# Altium schematic sheet Transmitter-2.4GHz.SchDoc
size B; SheetNumber: 2; SheetTotal: 4
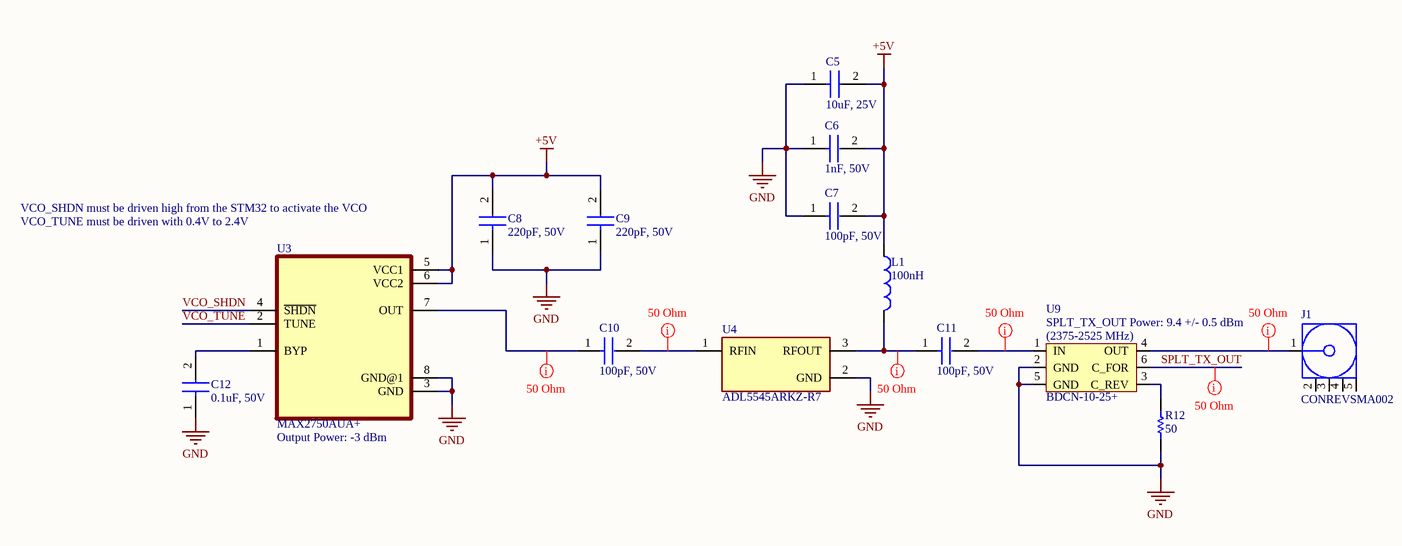
[diagram p0: Transmitter-2.4GHz.SchDoc]

## Parts
C5  10uF, 25V  [CAP_CL31_SAM]
C6  1nF, 50V  [FP-0603-L_1_6_0_15-W_0_81-IPC_C]
C7  100pF, 50V  [CAPC17595_87N_KEM]
C8  220pF, 50V  [CAPC17595_87N_KEM]
C9  220pF, 50V  [CAPC17595_87N_KEM]
C10  100pF, 50V  [CAP_CC0402_YAG]
C11  100pF, 50V  [CAP_CC0402_YAG]
C12  0.1uF, 50V  [CAP_CC0603_YAG-M]
J1  CONREVSMA002  [CON-REVSMA-RA]
L1  100nH  [INDC1608X95N]
R12  50  [RESC1005X35N]
U3  MAX2750AUA+  [SOP65P490X110-8N]
U4  ADL5545ARKZ-R7  [ADL5545ARKZ-R7]
U9  BDCN-10-25+  [BDCN-10-25+]

## Nets
+5V: C5.2 C6.2 C7.2 C8.2 C9.2 L1.1 U3.5(VCC1) U3.6(VCC2)
GND: C5.1 C6.1 C7.1 C8.1 C9.1 C12.1 R12.1 U3.3(GND) U3.8(GND@1) U4.2(GND) U9.2(GND) U9.5(GND)
SPLT_TX_OUT: U9.6(C_FOR)
VCO_SHDN: U3.4(~{SHDN})
VCO_TUNE: U3.2(TUNE)
NetC10_1: C10.1 U3.7(OUT)
NetC10_2: C10.2 U4.1(RFIN)
NetC11_1: C11.1 L1.2 U4.3(RFOUT)
NetC11_2: C11.2 U9.1(IN)
NetC12_2: C12.2 U3.1(BYP)
NetJ1_1: J1.1(Signal) U9.4(OUT)
NetR12_2: R12.2 U9.3(C_REV)

Not connected (* = marked no-connect by the designer): J1 2(GND) 3(GND) 4(GND) 5(GND)

## Layout directives
net class RF_Trace: NetC10_1, NetC10_2, NetC11_1, NetC11_2, NetJ1_1, SPLT_TX_OUT

## Notes on the sheet
- VCO_SHDN must be driven high from the STM32 to activate the VCO
- (near U3) VCO_TUNE must be driven with 0.4V to 2.4V
- (near U9) SPLT_TX_OUT Power: 9.4 +/- 0.5 dBm
- (near U9) (2375-2525 MHz)
- (near U3) Output Power: -3 dBm

## Library data of the parts
C5 = CL31B106KAHNNNE: Ceramic Capacitor, Multilayer, Ceramic, 25V, 10% +Tol, 10% -Tol, X7R, 15% TC, 10uF, Surface Mount, 1206; Manufacturer: Samsung; Multilayer: Yes; Supplier: Digikey; Supplier Part Number: 1276-1804-1-ND; Manufacturer Part Number: CL31B106KAHNNNE; RoHS: Yes; Category: Ceramic Capacitors; Stock: 2651645; Pricing: 1=0.1, 10=0.043, 100=0.0358 (USD); Mounting Technology: Surface Mount; Pins: 2; Dielectric Material: Ceramic; Package Shape: Rectangular; Case/Package: 1206; Terminal Finish: Nickel; Min Operating Temperature: -55°C; Max Operating Temperature: 125°C; JESD-609 Code: e3; Value: 10uF; Capacitor Type: Ceramic; Tolerance  (fill in as +-): 10%; Package Style: SMTMeter; Packaging: Tape and Reel; Tolerance (fill in as +-): 10%; Rated DC Voltage (URdc): 25V; Temperature Characteristics Code: X7R; Termination: Wraparound; Length: 3.2mm; Width: 1.6mm; Height: 1.8mm; Reach SVHC Compliant: Yes; RoHS Compliant: Yes; ComponentLink1URL: https://datasheet.ciiva.com:443/pdfs/VipMasterIC/IC/SEMS/SEMS-S-A0008384515/SEMS-S-A0008872888-1.pdf?src-supplier=IHS+Markit; ComponentLink1Description: https://datasheet.ciiva.com:443/pdfs/VipMasterIC/IC/SEMS/SEMS-S-A0008384515/SEMS-S-A0008872888-1.pdf?src-supplier=IHS+Markit; ComponentLink2URL: https://datasheet.ciiva.com/25795/cl31b106kahnnne-25795260.pdf?src-supplier=Digikey; ComponentLink2Description: https://datasheet.ciiva.com/25795/cl31b106kahnnne-25795260.pdf?src-supplier=Digikey; ComponentLink3URL: https://datasheet.ciiva.com/26838/getdatasheetpartid-356415-26838914.pdf?src-supplier=Verical; ComponentLink3Description: https://datasheet.ciiva.com/26838/getdatasheetpartid-356415-26838914.pdf?src-supplier=Verical; ComponentLink4URL: https://datasheet.ciiva.com/16498/cl03a105mq3csnc-16498474.pdf?src-supplier=Future+Electronics; ComponentLink4Description: https://datasheet.ciiva.com/16498/cl03a105mq3csnc-16498474.pdf?src-supplier=Future+Electronics
C6 = 06035A102JAT2A: Ceramic Capacitor, Multilayer, Ceramic, 50V, 5% +Tol, 5% -Tol, C0G, 30ppm/Cel TC, 0.001uF, Surface Mount, 0603; Manufacturer: Kyocera AVX; Multilayer: Yes; Supplier: Digikey; Supplier Part Number: 478-KGM15ACG1H102JTCT-ND; Manufacturer Part Number: 06035A102JAT2A; RoHS: Yes; Category: Ceramic Capacitors; Stock: 540000; Pricing: 4000=0.00488, 8000=0.00454, 16000=0.00447, 24000=0.00439, 32000=0.00431 (USD); Mounting Technology: Surface Mount; Pins: 2; Dielectric Material: Ceramic; Package Shape: Rectangular; Case/Package: 0603; Terminal Finish: Nickel; Min Operating Temperature: -55°C; Max Operating Temperature: 125°C; JESD-609 Code: e3; Value: 1nF; Capacitor Type: Ceramic; Tolerance  (fill in as +-): 5%; Package Style: SMTMeter; Packaging: Tape and Reel; Tolerance (fill in as +-): 5%; Rated DC Voltage (URdc): 50V; Temperature Characteristics Code: C0G; Termination: Wraparound; Length: 1.6mm; Width: 0.81mm; Height: 0.9mm; RoHS Compliant: Yes; Reach SVHC Compliant: Yes; ComponentLink1URL: https://datasheet.ciiva.com:443/pdfs/VipMasterIC/IC/AVXC/AVXC-S-A0008899940/AVXC-S-A0008899940-1.pdf?src-supplier=IHS+Markit; ComponentLink1Description: https://datasheet.ciiva.com:443/pdfs/VipMasterIC/IC/AVXC/AVXC-S-A0008899940/AVXC-S-A0008899940-1.pdf?src-supplier=IHS+Markit; ComponentLink2URL: https://datasheet.ciiva.com/11786/0900766b802d4697-11786950.pdf?src-supplier=Rs; ComponentLink2Description: https://datasheet.ciiva.com/11786/0900766b802d4697-11786950.pdf?src-supplier=Rs; ComponentLink3URL: https://datasheet.ciiva.com/11464/ccog-11464573.pdf?src-supplier=Avnet; ComponentLink3Description: https://datasheet.ciiva.com/11464/ccog-11464573.pdf?src-supplier=Avnet; ComponentLink4URL: https://datasheet.ciiva.com/16363/ccog-16363640.pdf?src-supplier=Future+Electronics; ComponentLink4Description: https://datasheet.ciiva.com/16363/ccog-16363640.pdf?src-supplier=Future+Electronics; ComponentLink5URL: https://datasheet.ciiva.com/1124/759117-1124717.pdf?src-supplier=Element14; ComponentLink5Description: https://datasheet.ciiva.com/1124/759117-1124717.pdf?src-supplier=Element14; ComponentLink6URL: https://datasheet.ciiva.com/1124/759117-1124716.pdf?src-supplier=Element14; ComponentLink6Description: https://datasheet.ciiva.com/1124/759117-1124716.pdf?src-supplier=Element14; ComponentLink7URL: https://datasheet.ciiva.com/1466/26712-1466099.pdf?src-supplier=Farnell; ComponentLink7Description: https://datasheet.ciiva.com/1466/26712-1466099.pdf?src-supplier=Farnell; ComponentLink8URL: https://datasheet.ciiva.com/1124/26712-1124715.pdf?src-supplier=Element14; ComponentLink8Description: https://datasheet.ciiva.com/1124/26712-1124715.pdf?src-supplier=Element14; ComponentLink9URL: https://datasheet.ciiva.com/150/ccog-150886.pdf?src-supplier=Digikey; ComponentLink9Description: https://datasheet.ciiva.com/150/ccog-150886.pdf?src-supplier=Digikey; ComponentLink10URL: https://datasheet.ciiva.com/150/ccog-150885.pdf?src-supplier=Digikey; ComponentLink10Description: https://datasheet.ciiva.com/150/ccog-150885.pdf?src-supplier=Digikey; ComponentLink11URL: https://datasheet.ciiva.com/150/ccog-150887.pdf?src-supplier=Digikey; ComponentLink11Description: https://datasheet.ciiva.com/150/ccog-150887.pdf?src-supplier=Digikey; ComponentLink12URL: https://datasheet.ciiva.com/14585/70001039-14585948.pdf?src-supplier=Allied+Electronics; ComponentLink12Description: https://datasheet.ciiva.com/14585/70001039-14585948.pdf?src-supplier=Allied+Electronics
C7 = C0603C101J5GACTU: Ceramic Capacitor, Multilayer, Ceramic, 50V, 5% +Tol, 5% -Tol, C0G, 30ppm/Cel TC, 0.0001uF, Surface Mount, 0603; Manufacturer: KEMET; Multilayer: Yes; Supplier: Digikey; Supplier Part Number: 399-C0603C101J5GACTUCT-ND; Manufacturer Part Number: C0603C101J5GACTU; RoHS: Yes; Category: Ceramic Capacitors; Stock: 772000; Pricing: 4000=0.0155, 8000=0.0104 (USD); Mounting Technology: Surface Mount; Pins: 2; Dielectric Material: Ceramic; Package Shape: Rectangular; Case/Package: 0603; Terminal Finish: Nickel; Min Operating Temperature: -55°C; Max Operating Temperature: 125°C; JESD-609 Code: e3; Value: 100pF; Capacitor Type: Ceramic; Tolerance  (fill in as +-): 5%; Package Style: SMTMeter; Packaging: Tape and Reel; Tolerance (fill in as +-): 5%; Rated DC Voltage (URdc): 50V; Temperature Characteristics Code: C0G; Termination: Wraparound; Length: 1.6mm; Width: 0.8mm; Height: 0.8mm; Reach SVHC Compliant: Yes; RoHS Compliant: Yes; ComponentLink1URL: https://datasheet.ciiva.com:443/pdfs/VipMasterIC/IC/KEME/KEME-S-A0005605168/KEME-S-A0005605168-1.pdf?src-supplier=IHS+Markit; ComponentLink1Description: https://datasheet.ciiva.com:443/pdfs/VipMasterIC/IC/KEME/KEME-S-A0005605168/KEME-S-A0005605168-1.pdf?src-supplier=IHS+Markit; ComponentLink2URL: https://datasheet.ciiva.com/6126/f9080b-0402-series-c0g-6126680.pdf?src-supplier=Farnell; ComponentLink2Description: https://datasheet.ciiva.com/6126/f9080b-0402-series-c0g-6126680.pdf?src-supplier=Farnell; ComponentLink3URL: https://datasheet.ciiva.com/28645/1789732-28645525.pdf?src-supplier=Element14; ComponentLink3Description: https://datasheet.ciiva.com/28645/1789732-28645525.pdf?src-supplier=Element14; ComponentLink4URL: https://datasheet.ciiva.com/7823/1725423-7823564.pdf?src-supplier=Element14; ComponentLink4Description: https://datasheet.ciiva.com/7823/1725423-7823564.pdf?src-supplier=Element14; ComponentLink5URL: https://datasheet.ciiva.com/7823/1725423-7823565.pdf?src-supplier=Element14; ComponentLink5Description: https://datasheet.ciiva.com/7823/1725423-7823565.pdf?src-supplier=Element14; ComponentLink6URL: https://datasheet.ciiva.com/7823/f9080b-0402-series-c0g-7823964.pdf?src-supplier=Element14; ComponentLink6Description: https://datasheet.ciiva.com/7823/f9080b-0402-series-c0g-7823964.pdf?src-supplier=Element14; ComponentLink7URL: https://datasheet.ciiva.com/7823/1372242-7823965.pdf?src-supplier=Element14; ComponentLink7Description: https://datasheet.ciiva.com/7823/1372242-7823965.pdf?src-supplier=Element14
C8 C9 = C0603C221J5GAC7411: Ceramic Capacitor, Multilayer, Ceramic, 50V, 5% +Tol, 5% -Tol, C0G, 30ppm/Cel TC, 0.00022uF, Surface Mount, 0603; Manufacturer: KEMET; Multilayer: Yes; Supplier: Digikey; Supplier Part Number: 399-C0603C221J5GAC7411CT-ND; Manufacturer Part Number: C0603C221J5GAC7411; RoHS: Yes; Category: Ceramic Capacitors; Stock: 30000; Pricing: 15000=0.0071, 30000=0.007, 45000=0.0069, 75000=0.0068, 150000=0.0067, 375000=0.0063, 750000=0.0063 (USD); Mounting Technology: Surface Mount; Pins: 2; Dielectric Material: Ceramic; Package Shape: Rectangular; Case/Package: 0603; Terminal Finish: Nickel; Min Operating Temperature: -55°C; Max Operating Temperature: 125°C; JESD-609 Code: e3; Value: 220pF; Capacitor Type: Ceramic; Tolerance  (fill in as +-): 5%; Package Style: SMTMeter; Packaging: Tape and Reel; Tolerance (fill in as +-): 5%; Rated DC Voltage (URdc): 50V; Temperature Characteristics Code: C0G; Termination: Wraparound; Length: 1.6mm; Width: 0.8mm; Height: 0.8mm; Reach SVHC Compliant: Yes; RoHS Compliant: Yes; ComponentLink1URL: https://datasheet.ciiva.com:443/pdfs/VipMasterIC/IC/KEME/KEME-S-A0007600110/KEME-S-A0007595965-1.pdf?src-supplier=IHS+Markit; ComponentLink1Description: https://datasheet.ciiva.com:443/pdfs/VipMasterIC/IC/KEME/KEME-S-A0007600110/KEME-S-A0007595965-1.pdf?src-supplier=IHS+Markit; ComponentLink2URL: https://datasheet.octopart.com/C0603C221J5GAC7411-KEMET-datasheet-149535035.pdf?src-supplier=Farnell; ComponentLink2Description: https://datasheet.octopart.com/C0603C221J5GAC7411-KEMET-datasheet-149535035.pdf?src-supplier=Farnell; ComponentLink3URL: https://api.kemet.com/component-edge/download/datasheet/C0603C221J5GAC7411.pdf?src-supplier=Digikey; ComponentLink3Description: https://api.kemet.com/component-edge/download/datasheet/C0603C221J5GAC7411.pdf?src-supplier=Digikey; ComponentLink4URL: https://datasheet.octopart.com/C0603C221J5GAC7411-Kemet-datasheet-11795438.pdf?src-supplier=Arrow+Electronics; ComponentLink4Description: https://datasheet.octopart.com/C0603C221J5GAC7411-Kemet-datasheet-11795438.pdf?src-supplier=Arrow+Electronics; ComponentLink5URL: https://datasheet.octopart.com/C0603C221J5GAC7411-Kemet-datasheet-5314449.pdf?src-supplier=Verical; ComponentLink5Description: https://datasheet.octopart.com/C0603C221J5GAC7411-Kemet-datasheet-5314449.pdf?src-supplier=Verical; ComponentLink6URL: https://datasheet.octopart.com/C0603C221J5GAC7411-KEMET-datasheet-157246123.pdf?src-supplier=Electro+Sonic; ComponentLink6Description: https://datasheet.octopart.com/C0603C221J5GAC7411-KEMET-datasheet-157246123.pdf?src-supplier=Electro+Sonic
C10 C11 = CC0402JRNPO9BN101: Ceramic Capacitor, Multilayer, Ceramic, 50V, 5% +Tol, 5% -Tol, C0G, 30ppm/Cel TC, 0.0001uF, Surface Mount, 0402; Manufacturer: Yageo; Multilayer: Yes; Supplier: Digikey; Supplier Part Number: 311-1024-1-ND; Manufacturer Part Number: CC0402JRNPO9BN101; RoHS: Yes; Category: Ceramic Capacitors; Stock: 5534890; Pricing: 1=0.08, 10=0.013, 100=0.008, 1000=0.0056, 2500=0.004, 10000=0.0032 (USD); Mounting Technology: Surface Mount; Pins: 2; Dielectric Material: Ceramic; Package Shape: Rectangular; Case/Package: 0402; Terminal Finish: Nickel; Min Operating Temperature: -55°C; Max Operating Temperature: 125°C; JESD-609 Code: e3; Value: 100pF; Capacitor Type: Ceramic; Tolerance  (fill in as +-): 5%; Package Style: SMTMeter; Packaging: Tape and Reel; Tolerance (fill in as +-): 5%; Rated DC Voltage (URdc): 50V; Temperature Characteristics Code: C0G; Termination: Wraparound; Length: 1mm; Width: 0.5mm; Height: 0.5mm; Reach SVHC Compliant: Yes; RoHS Compliant: Yes; ComponentLink1URL: https://datasheet.ciiva.com:443/pdfs/VipMasterIC/IC/YAGO/YAGO-S-A0009251638/YAGO-S-A0009251638-1.pdf?src-supplier=IHS+Markit; ComponentLink1Description: https://datasheet.ciiva.com:443/pdfs/VipMasterIC/IC/YAGO/YAGO-S-A0009251638/YAGO-S-A0009251638-1.pdf?src-supplier=IHS+Markit; ComponentLink2URL: https://datasheet.ciiva.com/23767/25787-23767888.pdf?src-supplier=Newark; ComponentLink2Description: https://datasheet.ciiva.com/23767/25787-23767888.pdf?src-supplier=Newark; ComponentLink3URL: https://datasheet.ciiva.com/11786/0900766b80d84fbf-11786101.pdf?src-supplier=Rs; ComponentLink3Description: https://datasheet.ciiva.com/11786/0900766b80d84fbf-11786101.pdf?src-supplier=Rs; ComponentLink4URL: https://datasheet.ciiva.com/28450/1443161-28450220.pdf?src-supplier=Element14; ComponentLink4Description: https://datasheet.ciiva.com/28450/1443161-28450220.pdf?src-supplier=Element14; ComponentLink5URL: https://datasheet.ciiva.com/143/mlccorderingcode-143989.pdf?src-supplier=Digikey; ComponentLink5Description: https://datasheet.ciiva.com/143/mlccorderingcode-143989.pdf?src-supplier=Digikey; ComponentLink6URL: https://datasheet.ciiva.com/143/mlccorderingcode-143990.pdf?src-supplier=Digikey; ComponentLink6Description: https://datasheet.ciiva.com/143/mlccorderingcode-143990.pdf?src-supplier=Digikey; ComponentLink7URL: https://datasheet.ciiva.com/143/mlccorderingcode-143991.pdf?src-supplier=Digikey; ComponentLink7Description: https://datasheet.ciiva.com/143/mlccorderingcode-143991.pdf?src-supplier=Digikey; ComponentLink8URL: https://datasheet.ciiva.com/8033/1443161-8033598.pdf?src-supplier=Element14; ComponentLink8Description: https://datasheet.ciiva.com/8033/1443161-8033598.pdf?src-supplier=Element14
C12 = CC0603JRX7R9BB104: Ceramic Capacitor, Multilayer, Ceramic, 50V, 5% +Tol, 5% -Tol, X7R, 15% TC, 0.1uF, Surface Mount, 0603; Manufacturer: Yageo; Value: 100nF; Multilayer: Yes; Supplier: Digikey; Supplier Part Number: 311-1779-1-ND; Manufacturer Part Number: CC0603JRX7R9BB104; RoHS: Yes; Category: Ceramic Capacitors; Stock: 91480; Pricing: 1=0.1, 10=0.05, 100=0.0297, 1000=0.01795 (USD); Mounting Technology: Surface Mount; Pins: 2; Dielectric Material: Ceramic; Package Shape: Rectangular; Case/Package: 0603; Terminal Finish: Nickel; Min Operating Temperature: -55°C; Max Operating Temperature: 125°C; JESD-609 Code: e3; Capacitor Type: Ceramic; Tolerance  (fill in as +-): 5%; Package Style: SMTMeter; Packaging: Tape and Reel; Tolerance (fill in as +-): 5%; Rated DC Voltage (URdc): 50V; Temperature Characteristics Code: X7R; Termination: Wraparound; Length: 1.6mm; Width: 0.8mm; Height: 0.8mm; Reach SVHC Compliant: Yes; RoHS Compliant: Yes; ComponentLink1URL: https://datasheet.ciiva.com:443/pdfs/VipMasterIC/IC/YAGO/YAGO-S-A0003557223/YAGO-S-A0003557223-1.pdf?src-supplier=IHS+Markit; ComponentLink1Description: https://datasheet.ciiva.com:443/pdfs/VipMasterIC/IC/YAGO/YAGO-S-A0003557223/YAGO-S-A0003557223-1.pdf?src-supplier=IHS+Markit; ComponentLink2URL: https://datasheet.ciiva.com/11465/upy-gphc-x7r-6-3v-to-50v-8-11465038.pdf?src-supplier=Avnet; ComponentLink2Description: https://datasheet.ciiva.com/11465/upy-gphc-x7r-6-3v-to-50v-8-11465038.pdf?src-supplier=Avnet
J1 = CONREVSMA002: RF SMA Connector; Manufacturer: Linx; Supplier: Digikey; Supplier Part Number: CONREVSMA002-ND; Manufacturer Part Number: CONREVSMA002; RoHS: Yes; Category: RF / Coaxial Connectors; Stock: 5396; Pricing: 1=2.78, 250=2.58, 500=2.41002, 1000=2.2625 (USD); Connector Type: SMA; Reach SVHC Compliant: Yes; RoHS Compliant: Yes; ComponentLink1URL: https://datasheet.ciiva.com:443/pdfs/VipMasterIC/IC/LNNC/LNNC-S-A0004850234/LNNC-S-A0004850234-1.pdf?src-supplier=IHS+Markit; ComponentLink1Description: https://datasheet.ciiva.com:443/pdfs/VipMasterIC/IC/LNNC/LNNC-S-A0004850234/LNNC-S-A0004850234-1.pdf?src-supplier=IHS+Markit; ComponentLink2URL: https://datasheet.ciiva.com/644/conrevsma002-644109.pdf?src-supplier=Digikey; ComponentLink2Description: https://datasheet.ciiva.com/644/conrevsma002-644109.pdf?src-supplier=Digikey; ComponentLink3URL: https://datasheet.ciiva.com/16225/conrevsma002-16225213.pdf?src-supplier=Future+Electronics; ComponentLink3Description: https://datasheet.ciiva.com/16225/conrevsma002-16225213.pdf?src-supplier=Future+Electronics
L1 = LQG18HNR10J00D: General Purpose Inductor, 0.1uH, 5%, 1 Element, Air-Core, SMD, 0603; Manufacturer: Murata; Core Material: Air; Case/Size Code: 0603; DC Resistance (DCR): 900mR; Inductor Application: RF INDUCTOR; Channels: 1; Quality Factor-Min (at L-nom): 12; Max Current Rating: 350mA; Self Resonant Frequency: 800MHz; Shape/Size Description: RECTANGULAR PACKAGE; Shielding: Unshielded; Test Frequency: 100MHz; Package Height: 0.8mm; Package Length: 1.6mm; Supplier: Digikey; Supplier Part Number: 490-6586-1-ND; Manufacturer Part Number: LQG18HNR10J00D; RoHS: Yes; Category: Fixed Inductors; Stock: 24486; Pricing: 1=0.18, 10=0.144, 50=0.144, 100=0.119, 1000=0.098, 10000=0.066 (USD); Pins: 2; Terminal Finish: Tin; Min Operating Temperature: -40°C; Max Operating Temperature: 85°C; Tolerance: 5%; JESD-609 Code: e3; Construction: Multilayer Chip; Inductance-Nom (L): 0.1uH; Inductor Type: GENERAL PURPOSE INDUCTOR; Package Style: SMTMeter; Packaging: Tape and Reel; Surface Mount: Yes; Terminal Placement: Dual Ended; Termination: Wraparound; Package Width: 0.8mm; Reach SVHC Compliant: Yes; RoHS Compliant: Yes; ComponentLink1URL: https://datasheet.ciiva.com:443/pdfs/VipMasterIC/IC/MURE/MURE-S-A0008911298/MURE-S-A0008911379-1.pdf?src-supplier=IHS+Markit; ComponentLink1Description: https://datasheet.ciiva.com:443/pdfs/VipMasterIC/IC/MURE/MURE-S-A0008911298/MURE-S-A0008911379-1.pdf?src-supplier=IHS+Markit; ComponentLink2URL: https://datasheet.ciiva.com/11801/0900766b80f1087c-11801431.pdf?src-supplier=Rs; ComponentLink2Description: https://datasheet.ciiva.com/11801/0900766b80f1087c-11801431.pdf?src-supplier=Rs; ComponentLink3URL: https://datasheet.ciiva.com/6710/l0075s0083lqg18h-6710060.pdf?src-supplier=Digikey; ComponentLink3Description: https://datasheet.ciiva.com/6710/l0075s0083lqg18h-6710060.pdf?src-supplier=Digikey; ComponentLink4URL: https://datasheet.ciiva.com/6710/l0075s0083lqg18h-6710062.pdf?src-supplier=Digikey; ComponentLink4Description: https://datasheet.ciiva.com/6710/l0075s0083lqg18h-6710062.pdf?src-supplier=Digikey; ComponentLink5URL: https://datasheet.ciiva.com/8002/5102-8002605.pdf?src-supplier=Element14; ComponentLink5Description: https://datasheet.ciiva.com/8002/5102-8002605.pdf?src-supplier=Element14; ComponentLink6URL: https://datasheet.ciiva.com/8002/5102-8002606.pdf?src-supplier=Element14; ComponentLink6Description: https://datasheet.ciiva.com/8002/5102-8002606.pdf?src-supplier=Element14
R12 = RT0402BRE0750RL: Fixed Resistor, Thin Film, 0.0625W, 50ohm, 50V, 0.1% +/-Tol, 50ppm/Cel, Surface Mount, 0402; Manufacturer: Yageo; Additional Feature: LASER TRIMMABLE; Power: 62.5mW; Rated Temperature: 70°C; Value: 50R; Supplier: Digikey; Supplier Part Number: 13-RT0402BRE0750RLCT-ND; Manufacturer Part Number: RT0402BRE0750RL; RoHS: Yes; Category: Chip SMD Resistors; Stock: 2520; Pricing: 1=0.18, 10=0.133, 50=0.1072, 100=0.0959, 500=0.0765, 1000=0.06834, 5000=0.05406 (USD); Mounting Technology: Surface Mount; Pins: 2; Package Shape: Rectangular; Case/Package: 0402; Min Operating Temperature: -55°C; Max Operating Temperature: 155°C; Tolerance: 0.1%; Resistor Type: FIXED RESISTOR; Packaging: Tape and Reel; Technology: THIN FILM; Termination: Wraparound; Working Voltage: 50V; Temperature Coefficient (ppm/Cel): 50; Reach SVHC Compliant: Yes; RoHS Compliant: Yes; ComponentLink1URL: https://datasheet.ciiva.com:443/pdfs/VipMasterIC/IC/YAGO/YAGO-S-A0003507815/YAGO-S-A0003507815-1.pdf?src-supplier=IHS+Markit; ComponentLink1Description: https://datasheet.ciiva.com:443/pdfs/VipMasterIC/IC/YAGO/YAGO-S-A0003507815/YAGO-S-A0003507815-1.pdf?src-supplier=IHS+Markit; ComponentLink2URL: http://www.yageo.com/documents/recent/PYu-RT_1-to-0.01_RoHS_L_9.pdf?src-supplier=Digikey; ComponentLink2Description: http://www.yageo.com/documents/recent/PYu-RT_1-to-0.01_RoHS_L_9.pdf?src-supplier=Digikey; ComponentLink3URL: https://datasheet.octopart.com/RT0402BRE0750RL-Yageo-datasheet-166250672.pdf?src-supplier=Future+Electronics; ComponentLink3Description: https://datasheet.octopart.com/RT0402BRE0750RL-Yageo-datasheet-166250672.pdf?src-supplier=Future+Electronics
U3 = MAX2750AUA+: Voltage Controlled Oscillator, 2370MHz Min, 2470MHz Max; Manufacturer: Maxim; Package Body Material: Plastic; Operating Frequency-Max: 2.47GHz; Operating Frequency-Min: 2.37GHz; Control Voltage-Max: 2.4V; Control Voltage-Min: 400mV; Offset Frequency: 4MHz; Output Power (dBm): -3dBm; Package Equivalence Code: TSSOP8,.19; Phase Noise: -125dBc/Hz; Power Supplies: 3/5V; Max Supply Current: 21mA; Max Supply Voltage: 5.5V; Min Supply Voltage: 2.7V; Qualification Status: Not Qualified; Supplier: Digikey; Supplier Part Number: MAX2750AUA+-ND; Manufacturer Part Number: MAX2750AUA+; RoHS: Yes; Category: Oscillators; Stock: 638; Pricing: 1=8.28, 10=7.191, 50=6.5428, 100=6.29, 250=5.97796, 500=5.7577, 1000=5.5503 (USD); Mounting Technology: Surface Mount; Pins: 8; Terminal Finish: Tin; Min Operating Temperature: -40°C; Max Operating Temperature: 125°C; JESD-609 Code: e3; Oscillator Type: VOLTAGE CONTROLLED OSCILLATOR; Manufacturer Series: MAX2750AUA; Reach SVHC Compliant: Yes; RoHS Compliant: Yes; ComponentLink1URL: https://datasheet.ciiva.com:443/pdfs/VipMasterIC/IC/MAXM/MAXM-S-A0000999237/MAXM-S-A0000999237-1.pdf?src-supplier=IHS+Markit; ComponentLink1Description: https://datasheet.ciiva.com:443/pdfs/VipMasterIC/IC/MAXM/MAXM-S-A0000999237/MAXM-S-A0000999237-1.pdf?src-supplier=IHS+Markit; ComponentLink2URL: https://datasheet.ciiva.com/2796/max2750aua-2796961.pdf?src-supplier=Digikey; ComponentLink2Description: https://datasheet.ciiva.com/2796/max2750aua-2796961.pdf?src-supplier=Digikey; ComponentLink3URL: https://datasheet.ciiva.com/12071/max2750aua-73109-12071954.pdf?src-supplier=Mouser; ComponentLink3Description: https://datasheet.ciiva.com/12071/max2750aua-73109-12071954.pdf?src-supplier=Mouser
U4 = ADL5545ARKZ-R7: Wide Band Medium Power Amplifier, 30MHz Min, 6000MHz Max, 1 Func, BIPolar; Manufacturer: Analog Devices; Supplier: Digikey; Supplier Part Number: 505-ADL5545ARKZ-R7CT-ND; Manufacturer Part Number: ADL5545ARKZ-R7; RoHS: Yes; Category: RF Amplifiers; Stock: 532; Pricing: 1=4.14, 10=3.577, 25=3.3816, 100=3.1132, 250=2.95236, 500=2.83876 (USD); RF/Microwave Device Type: WIDE BAND MEDIUM POWER; Reach SVHC Compliant: Yes; RoHS Compliant: Yes; ComponentLink1URL: https://datasheet.ciiva.com:443/pdfs/VipMasterIC/IC/ANDI/ANDIS19839/ANDIS19839-1.pdf?src-supplier=IHS+Markit; ComponentLink1Description: https://datasheet.ciiva.com:443/pdfs/VipMasterIC/IC/ANDI/ANDIS19839/ANDIS19839-1.pdf?src-supplier=IHS+Markit; ComponentLink2URL: https://datasheet.ciiva.com/18576/adl5545-18576150.pdf?src-supplier=Digikey; ComponentLink2Description: https://datasheet.ciiva.com/18576/adl5545-18576150.pdf?src-supplier=Digikey; ComponentLink3URL: https://datasheet.ciiva.com/22628/1800592-22628003.pdf?src-supplier=Element14; ComponentLink3Description: https://datasheet.ciiva.com/22628/1800592-22628003.pdf?src-supplier=Element14; ComponentLink4URL: https://datasheet.ciiva.com/18576/adl5545-18576151.pdf?src-supplier=Digikey; ComponentLink4Description: https://datasheet.ciiva.com/18576/adl5545-18576151.pdf?src-supplier=Digikey; ComponentLink5URL: https://datasheet.ciiva.com/18576/adl5545-18576152.pdf?src-supplier=Digikey; ComponentLink5Description: https://datasheet.ciiva.com/18576/adl5545-18576152.pdf?src-supplier=Digikey
U9 = BDCN-10-25+: Bi-Directional Coupler, 824MHz Min, 2525MHz Max, 1.5dB Insertion Loss-Max; Manufacturer: Mini-Circuits; Characteristic Impedance: 50R; Operating Frequency-Max: 2.525GHz; VSWR-Max: 1.2; Supplier: Digikey; Supplier Part Number: 3157-BDCN-10-25+CT-ND; Manufacturer Part Number: BDCN-10-25+; RoHS: Yes; Stock: 5826; Pricing: 1=5.44, 20=4.932, 50=4.476, 100=4.176, 200=3.84, 500=3.55202, 1000=3.5037 (USD); Terminal Finish: Nickel; Min Operating Temperature: -55°C; Max Operating Temperature: 100°C; JESD-609 Code: e3; Construction: COMPONENT; Insertion Loss-Max: 1.5dB; Operating Frequency-Min: 824MHz; RF/Microwave Device Type: BI-DIRECTIONAL COUPLER; Reach SVHC Compliant: Yes; RoHS Compliant: Yes; ComponentLink1URL: https://datasheet.ciiva.com:443/pdfs/VipMasterIC/IC/MINI/MINI-S-A0002822080/MINI-S-A0002822080-1.pdf?src-supplier=IHS+Markit; ComponentLink1Description: https://datasheet.ciiva.com:443/pdfs/VipMasterIC/IC/MINI/MINI-S-A0002822080/MINI-S-A0002822080-1.pdf?src-supplier=IHS+Markit; ComponentLink2URL: http://datasheet.octopart.com/BDCN-10-25%2B-Mini-Circuits-datasheet-8617095.pdf?src-supplier=Digikey; ComponentLink2Description: http://datasheet.octopart.com/BDCN-10-25%2B-Mini-Circuits-datasheet-8617095.pdf?src-supplier=Digikey; ComponentLink3URL: http://datasheet.octopart.com/BDCN-10-25%2B-Mini-Circuits-datasheet-8617095.pdf?src-supplier=Mouser; ComponentLink3Description: http://datasheet.octopart.com/BDCN-10-25%2B-Mini-Circuits-datasheet-8617095.pdf?src-supplier=Mouser